# EAGLE schematic Sidblaster TicTac - Rev.1.2 (EAGLE 7.7.0)
CNAME: crazy-midi.de
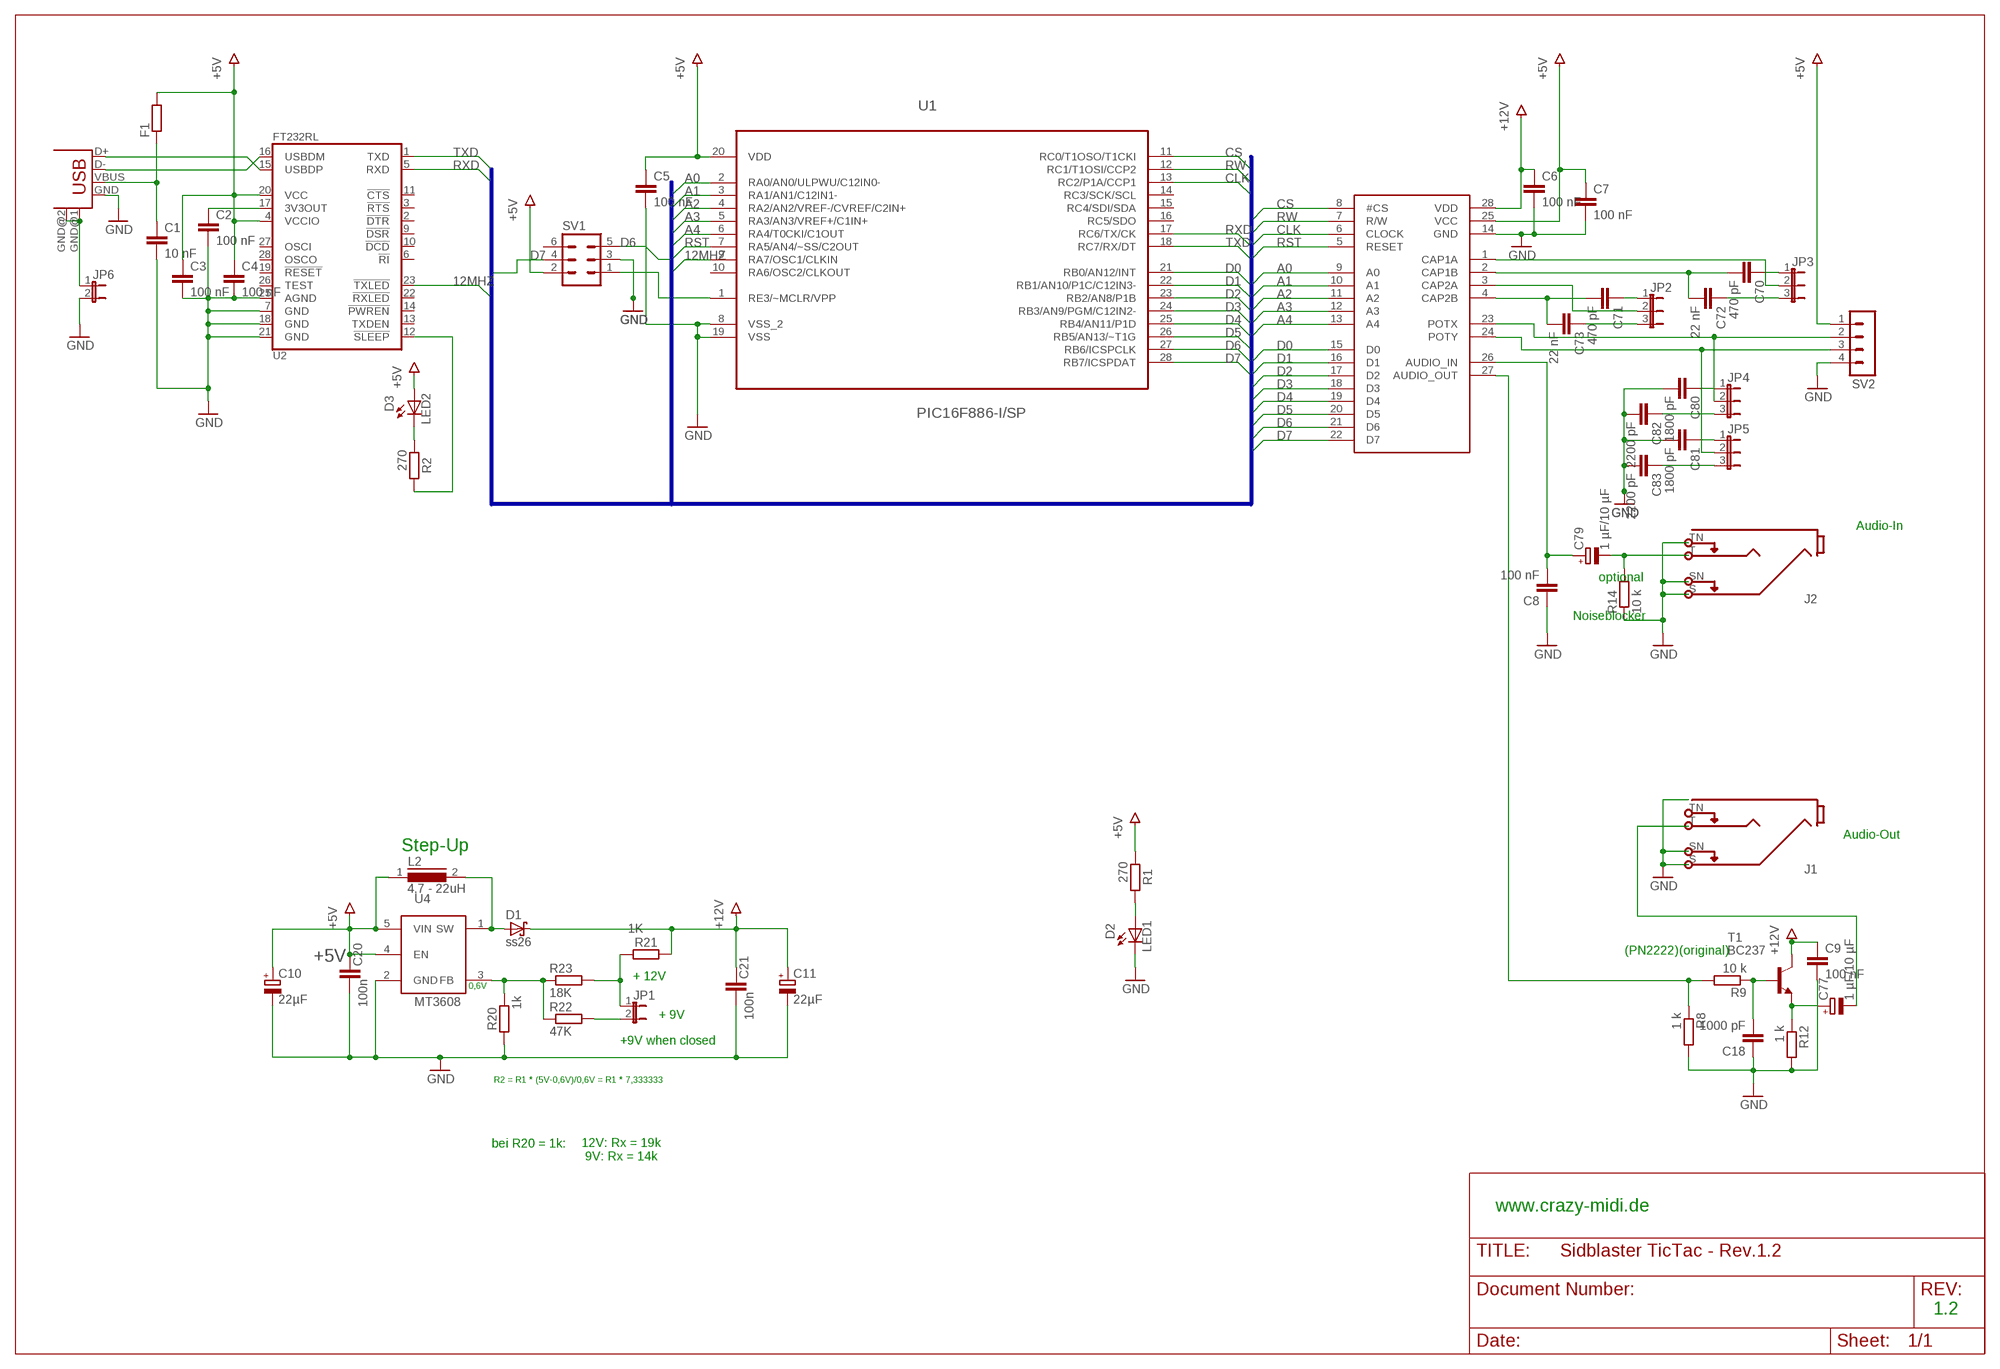
[diagram p0: schematic, sheet 1]

## Parts
C1  10 nF  C-EUC0805K  [C0805K]
C2  100 nF  C-EUC0805K  [C0805K]
C3  100 nF  C-EUC0805K  [C0805K]
C4  100 nF  C-EUC0805K  [C0805K]
C5  100 nF  C-EUC0805K  [C0805K]
C6  100 nF  C-EUC0805K  [C0805K]
C7  100 nF  C-EUC0805K  [C0805K]
C8  100 nF  C-EU025-025X050  [C025-025X050]
C9  100 nF  C-EU025-025X050  [C025-025X050]
C10  22µF  CPOL-EUE2-4  [E2-4]
C11  22µF  CPOL-EUE2-4  [E2-4]
C18  1000 pF  C-EU025-025X050  [C025-025X050]
C20  100n  C-EUC0805K  [C0805K]
C21  100n  C-EUC0805K  [C0805K]
C70  470 pF  C-EU025-025X050  [C025-025X050]
C71  470 pF  C-EU025-025X050  [C025-025X050]
C72  22 nF  C-EU025-025X050  [C025-025X050]
C73  22 nF  C-EU025-025X050  [C025-025X050]
C77  1 µF/10 µF  CPOL-EUE5-5  [E5-5]
C79  1 µF/10 µF  CPOL-EUE5-5  [E5-5]
C80  1800 pF  C-EU025-025X050  [C025-025X050]
C81  1800 pF  C-EU025-025X050  [C025-025X050]
C82  2200 pF  C-EU025-025X050  [C025-025X050]
C83  2200 pF  C-EU025-025X050  [C025-025X050]
D1  ss26  SCHOTTKY-DIODESMD  [SMB]
D2  LED1  LEDCHIPLED_1206  [CHIPLED_1206]
D3  LED2  LEDCHIPLED_1206  [CHIPLED_1206]
F1  R-EU_0207/5V  [0207/5V]
J1  MONOSW2  [NEUTRIK-NRJ4HF]
J2  MONOSW2  [NEUTRIK-NRJ4HF]
JP1  JP1E  [JP1]
JP2  JP2E  [JP2]
JP3  JP2E  [JP2]
JP4  JP2E  [JP2]
JP5  JP2E  [JP2]
JP6  JP1E  [JP1]
L2  4,7 - 22uH  1212_FPS  [FPS]
R1  270  R-EU_M0805  [M0805]
R2  270  R-EU_M0805  [M0805]
R8  1 k  R-EU_0207/10  [0207/10]
R9  10 k  R-EU_0207/10  [0207/10]
R12  1 k  R-EU_0207/10  [0207/10]
R14  10 k  R-EU_0207/10  [0207/10]
R20  1k  R-EU_M0805  [M0805]
R21  1K  R-EU_M0805  [M0805]
R22  47K  R-EU_M0805  [M0805]
R23  18K  R-EU_M0805  [M0805]
SV1  MA03-2  [MA03-2]
SV2  MA04-1  [MA04-1]
T1  BC237  [TO92]
U1  PIC16F886-I/SP  [DIP254P762X508-28]
U2  FT232RL  [SSOP28-LD]
U3  6581  [DIL28-6]
U4  MT3608  [SOT23-6]
X1  USB-B-H  [USB-B-H]

## Nets
12MHZ: U1.9(RA7/OSC1/CLKIN) U2.23(!TXLED)
+5V: C3.1 C4.1 C5.1 C7.1 C10.+ C20.2 D3.A F1.2 L2.1 R1.2 SV1.2 SV2.1 U1.20(VDD) U2.4(VCCIO) U2.20(VCC) U3.25(VCC) U4.4(EN) U4.5(VIN)
+12V: C6.1 C9.1 C11.+ C21.2 D1.C R21.1 T1.3(C) U3.28(VDD)
A0: U1.2(RA0/AN0/ULPWU/C12IN0-) U3.9(A0)
A1: U1.3(RA1/AN1/C12IN1-) U3.10(A1)
A2: U1.4(RA2/AN2/VREF-/CVREF/C2IN+) U3.11(A2)
A3: U1.5(RA3/AN3/VREF+/C1IN+) U3.12(A3)
A4: U1.6(RA4/T0CKI/C1OUT) U3.13(A4)
C1: C2.1 U2.17(3V3OUT)
CLK: U1.13(RC2/P1A/CCP1) U3.6(CLOCK)
CS: U1.11(RC0/T1OSO/T1CKI) U3.8(#CS)
D0: U1.21(RB0/AN12/INT) U3.15(D0)
D1: U1.22(RB1/AN10/P1C/C12IN3-) U3.16(D1)
D2: U1.23(RB2/AN8/P1B) U3.17(D2)
D3: U1.24(RB3/AN9/PGM/C12IN2-) U3.18(D3)
D4: U1.25(RB4/AN11/P1D) U3.19(D4)
D5: U1.26(RB5/AN13/~T1G) U3.20(D5)
D6: SV1.5 U1.27(RB6/ICSPCLK) U3.21(D6)
D7: SV1.4 U1.28(RB7/ICSPDAT) U3.22(D7)
GND: C1.2 C2.2 C3.2 C4.2 C5.2 C6.2 C7.2 C8.1 C9.2 C10.- C11.- C18.1 C20.1 C21.1 C80.2 C81.2 C82.2 C83.2 D2.C J1.S J1.SN J2.S J2.SN J2.TN JP6.2 R8.2 R12.2 R14.1 R20.2 SV1.3 SV2.4 U1.8(VSS_2) U1.19(VSS) U2.7(GND) U2.18(GND) U2.21(GND) U2.25(AGND) U3.14(GND) U4.2(GND) X1.GND
N$1: C8.2 C79.+ U3.26(AUDIO_IN)
N$2: U2.15(USBDP) X1.D+
N$3: C79.- J2.T R14.2
N$4: C71.1 JP2.1
N$5: R8.1 R9.2 U3.27(AUDIO_OUT)
N$6: JP1.1 R21.2 R23.2
N$7: C71.2 C73.2 U3.4(CAP2B)
N$8: C73.1 JP2.3
N$9: JP2.2 U3.3(CAP2A)
N$10: C70.2 C72.2 U3.2(CAP1B)
N$11: C70.1 JP3.1
N$12: C72.1 JP3.3
N$13: JP3.2 U3.1(CAP1A)
N$14: JP4.2 SV2.2 U3.23(POTX)
N$15: U2.16(USBDM) X1.D-
N$16: SV1.1 U1.1(RE3/~MCLR/VPP)
N$17: JP5.2 SV2.3 U3.24(POTY)
N$18: C77.- J1.T
N$19: C18.2 R9.1 T1.2(B)
N$20: C77.+ R12.1 T1.1(E)
N$21: D1.A L2.2 U4.1(SW)
N$22: JP1.2 R22.2
N$23: D2.A R1.1
N$24: D3.C R2.2
N$25: C1.1 F1.1 X1.VBUS
N$26: C80.1 JP4.1
N$27: C82.1 JP4.3
N$28: R2.1 U2.12(!SLEEP)
N$29: JP6.1 X1.GND@1(GND) X1.GND@2(GND)
N$30: C81.1 JP5.1
N$31: C83.1 JP5.3
R22: R20.1 R22.1 R23.1 U4.3(FB)
RST: U1.7(RA5/AN4/~SS/C2OUT) U3.5(RESET)
RW: U1.12(RC1/T1OSI/CCP2) U3.7(R/W)
RXD: U1.17(RC6/TX/CK) U2.5(RXD)
TXD: U1.18(RC7/RX/DT) U2.1(TXD)
Unconnected: J1.TN SV1.6 U1.10(RA6/OSC2/CLKOUT) U1.14(RC3/SCK/SCL) U1.15(RC4/SDI/SDA) U1.16(RC5/SDO) U2.2(!DTR) U2.3(!RTS) U2.6(!RI) U2.9(!DSR) U2.10(!DCD) U2.11(!CTS) U2.13(TXDEN) U2.14(!PWREN) U2.19(!RESET) U2.22(!RXLED) U2.26(TEST) U2.27(OSCI) U2.28(OSCO)

## Buses
RXD,TXD,12MHZ,A[0..4],D[0..7],CS,RW,CLK,RST

## Notes on the sheet
- Audio-In
- optional
- Noiseblocker
- Audio-Out
- Step-Up
- (PN2222)(original)
- + 12V
- 0,6V
- + 9V
- +9V when closed
- R2 = R1 * (5V-0,6V)/0,6V = R1 * 7,333333
- bei R20 = 1k:
- 12V: Rx = 19k
   9V: Rx = 14k
- www.crazy-midi.de
- 1.2

## Library data of the parts
C1-C9 C18 C20 C21 C70-C73 C80-C83 = rcl:C-EU: CAPACITOR, European symbol
C10 C11 C77 C79 = rcl:CPOL-EU: POLARIZED CAPACITOR, European symbol
D1 = diode:SCHOTTKY-DIODE: Schottky Diode
D2 D3 = led:LED: LED OSRAM: - CHIPLED LG R971, LG N971, LY N971, LG Q971, LY Q971, LO R971, LY R971 LH N974, LH R974 LS Q976, LO Q976, LY Q976 LO Q996 - Hyper CHIPLED LW Q18S LB Q993, LB Q99A, LB R99A - SideLED LS A670, LO A670, LY A670, LG A670, LP A670 LB A673, LV A673, LT A673, LW A673 LH A674 LY A675 LS A676, LA A676, LO A676, LY A676, LW A676 LS A679, LY A679, LG A679 - Hyper Micro SIDELED® LS Y876, LA Y876, LO Y876, LY Y876 LT Y87S - SmartLED LW L88C, LW L88S LB L89C, LB L89S, LG L890 LS L89K, LO L89K, LY L89K LS L896, LA L896, LO L896, LY L896 - TOPLED LS T670, LO T670, LY T670, LG T670, LP T670 LSG T670, LSP T670, LSY T670, LOP T670, LYG T670 LG T671, LOG T671, LSG T671 LB T673, LV T673, LT T673, LW T673 LH T674 LS T676, LA T676, LO T676, LY T676, LB T676, LH T676, LSB T676, LW T676 LB T67C, LV T67C, LT T67C, LS T67K, LO T67K, LY T67K, LW E67C LS E67B, LA E67B, LO E67B, LY E67B, LB E67C, LV E67C, LT E67C LW T67C LS T679, LY T679, LG T679 LS T770, LO T770, LY T770, LG T770, LP T770 LB T773, LV T773, LT T773, LW T773 LH T774 LS E675, LA E675, LY E675, LS T675 LS T776, LA T776, LO T776, LY T776, LB T776 LHGB T686 LT T68C, LB T68C - Hyper Mini TOPLED® LB M676 - Mini TOPLED Santana® LG M470 LS M47K, LO M47K, LY M47K Source: http://www.osram.convergy.de LUXEON: - LUMILED® LXK2-PW12-R00, LXK2-PW12-S00, LXK2-PW14-U00, LXK2-PW14-V00 LXK2-PM12-R00, LXK2-PM12-S00, LXK2-PM14-U00 LXK2-PE12-Q00, LXK2-PE12-R00, LXK2-PE12-S00, LXK2-PE14-T00, LXK2-PE14-U00 LXK2-PB12-K00, LXK2-PB12-L00, LXK2-PB12-M00, LXK2-PB14-N00, LXK2-PB14-P00, LXK2-PB14-Q00 LXK2-PR12-L00, LXK2-PR12-M00, LXK2-PR14-Q00, LXK2-PR14-R00 LXK2-PD12-Q00, LXK2-PD12-R00, LXK2-PD12-S00 LXK2-PH12-R00, LXK2-PH12-S00 LXK2-PL12-P00, LXK2-PL12-Q00, LXK2-PL12-R00 Source: www.luxeon.com KINGBRIGHT: KA-3528ASYC Source: www.kingbright.com
F1 R1 R2 R8 R9 R12 R14 R20-R23 = rcl:R-EU_: RESISTOR, European symbol
J1 J2 = Audio Jacks 0.25 inch:MONOSW2: 1/4" mono jack, switched
JP1 JP6 = jumper:JP1E: JUMPER
JP2-JP5 = jumper:JP2E: JUMPER
L2 = my_inductors:1212_FPS
SV1 = con-lstb:MA03-2: PIN HEADER; OC_FARNELL: unknown; OC_NEWARK: unknown
SV2 = con-lstb:MA04-1: PIN HEADER; OC_FARNELL: unknown; OC_NEWARK: unknown
T1 = transistor:BC237: NPN TRANSISTOR
U1 = PIC16F886-I_SP:PIC16F886-I/SP: 8-Bit CMOS Microcontrollers; AVAILABILITY: Good; DESCRIPTION: PIC16 Series 128 B RAM 3.5 kB Flash 8-Bit CMOS Microcontroller - SDIP-28; MF: Microchip; MP: PIC16F886-I/SP; PACKAGE: DIP-28 Microchip; PRICE: 2.19 USD
U2 = FT232RL:FT232RL; AVAILABILITY: Good; DESCRIPTION: Interface; USB-UART; Full Speed; SSOP28; MF: FTDI; MP: FT232RL; PACKAGE: SSOP-28 FTDI; PRICE: 4.89 USD
U3 = Mos6581_sid:6581: The Famous C64 Sound Chip - MOS6581
U4 = kwr-master-2016-08:MT3608: Boost sot23-6
X1 = con-usb-2:USB: USB Connectors